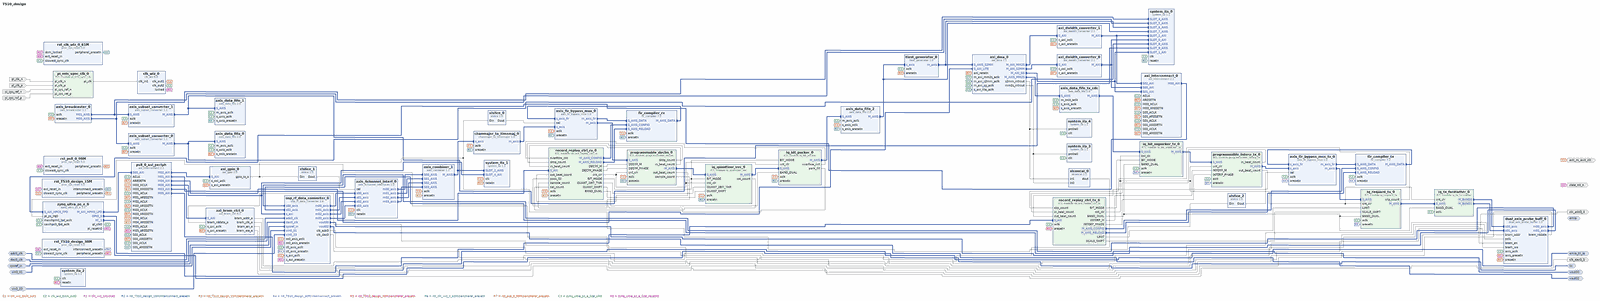
[diagram p0: block diagram of the top level, whole]
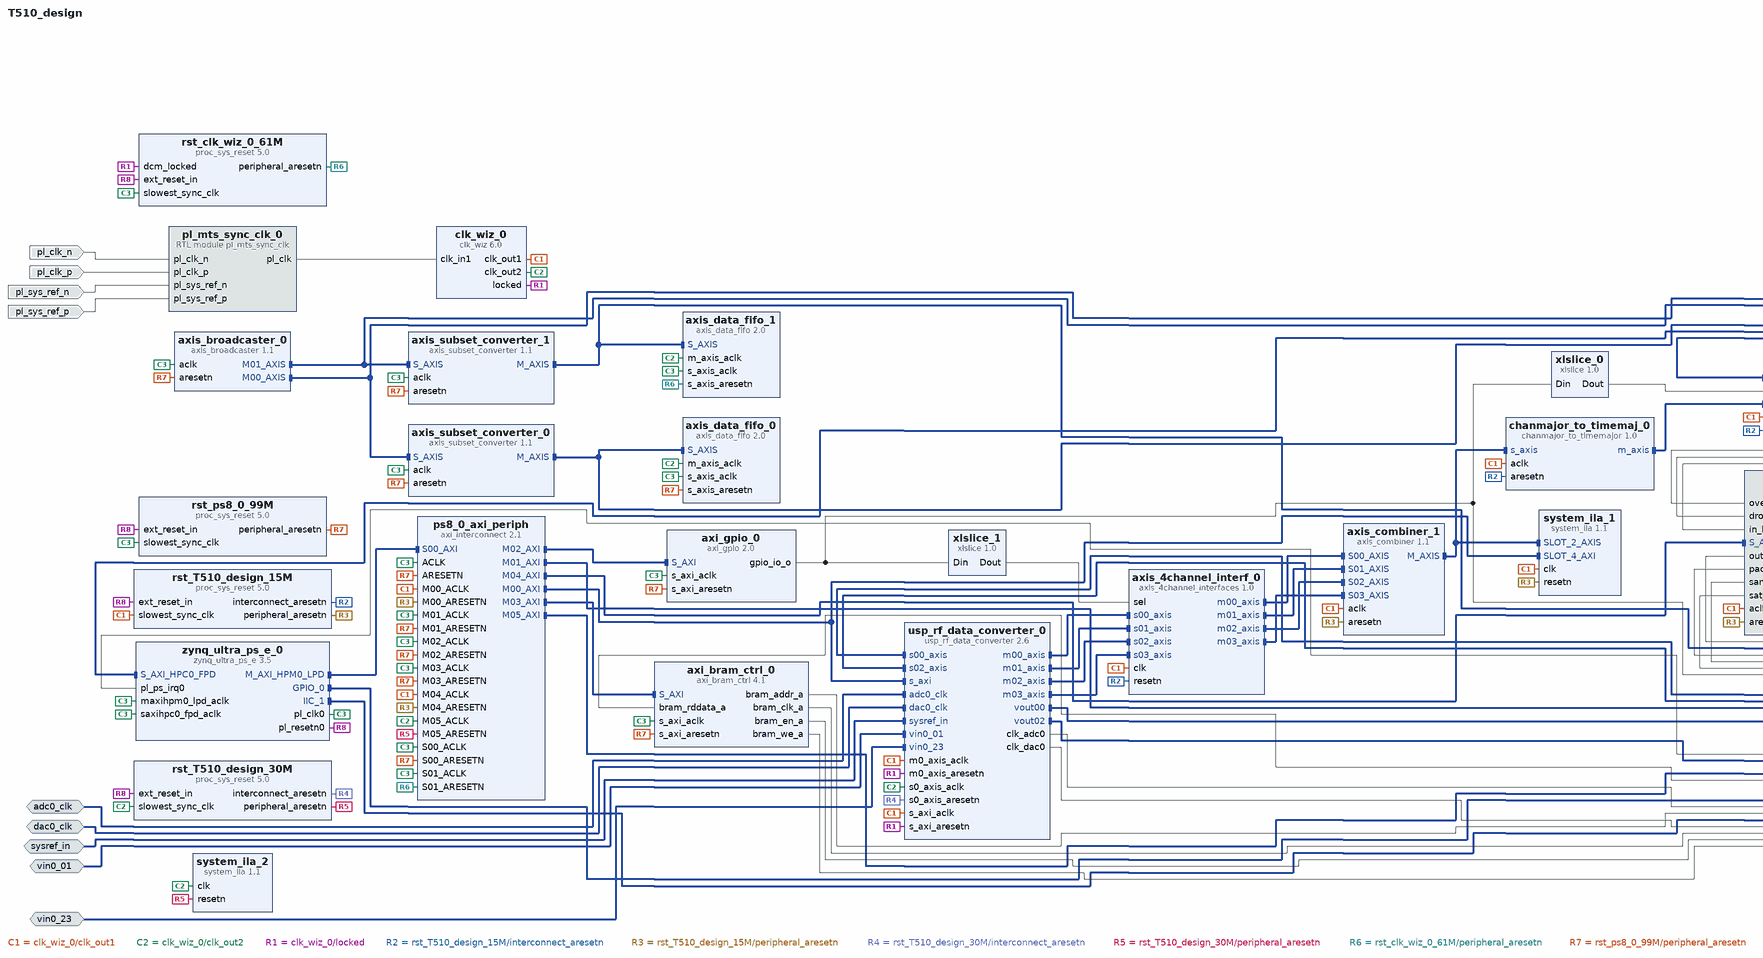
[diagram p1: block diagram of the top level, left part]
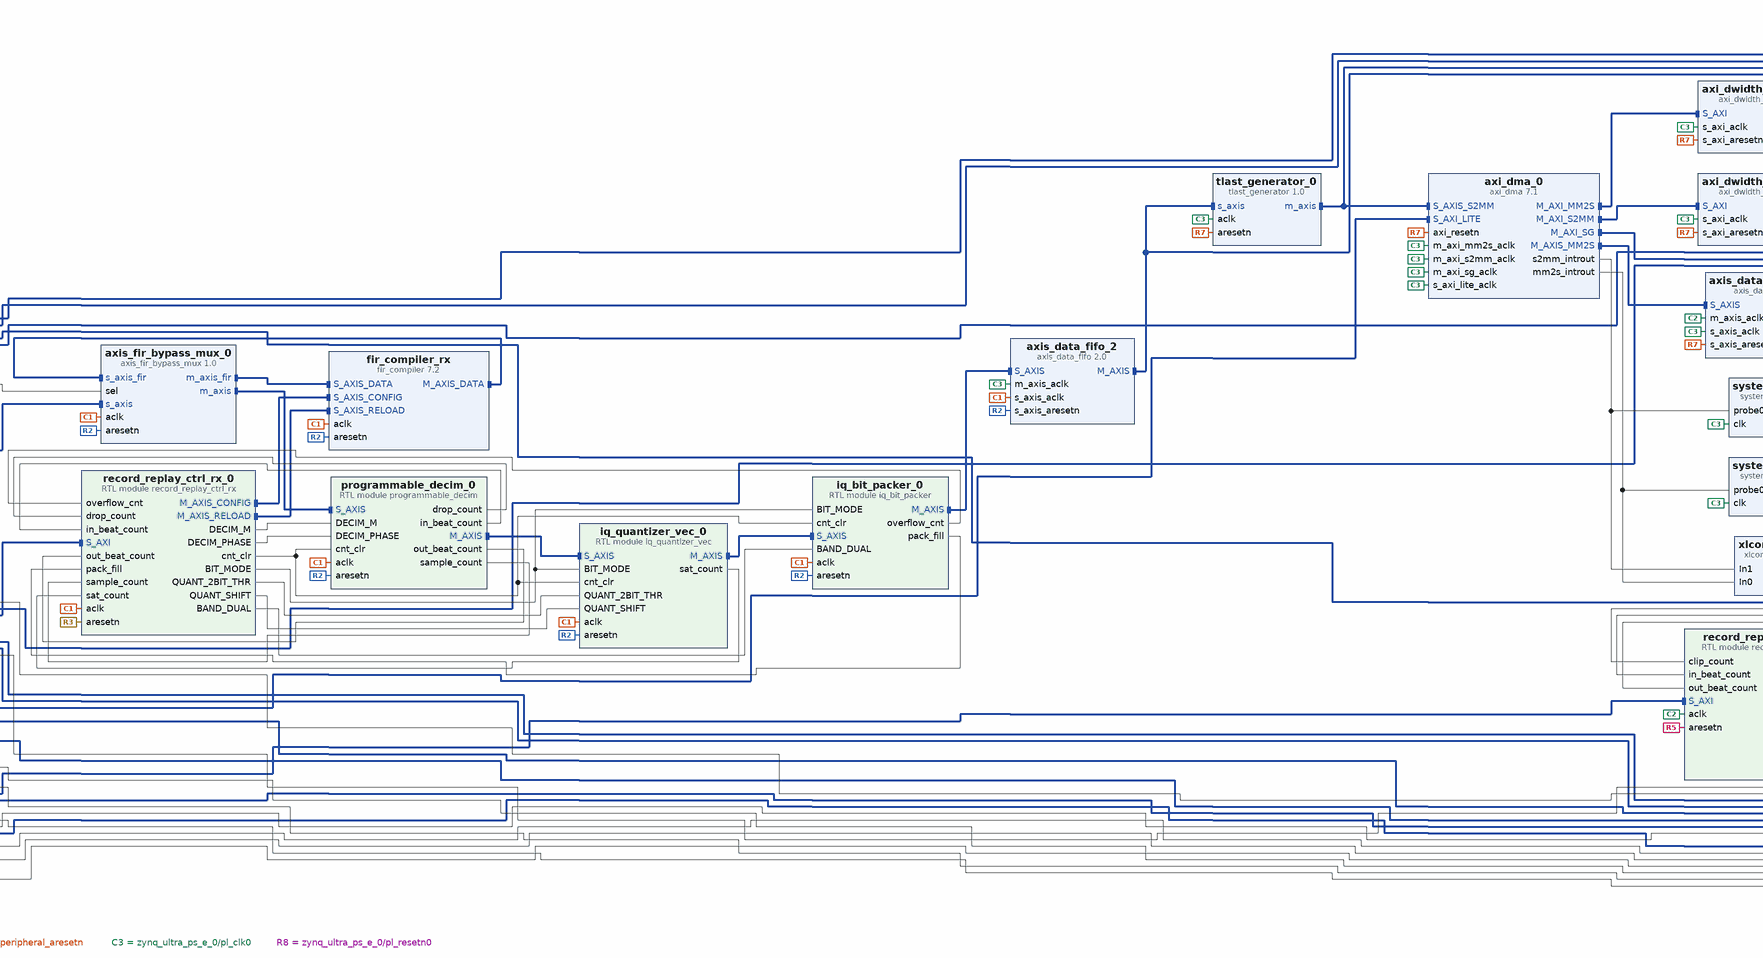
[diagram p2: block diagram of the top level, centre part]
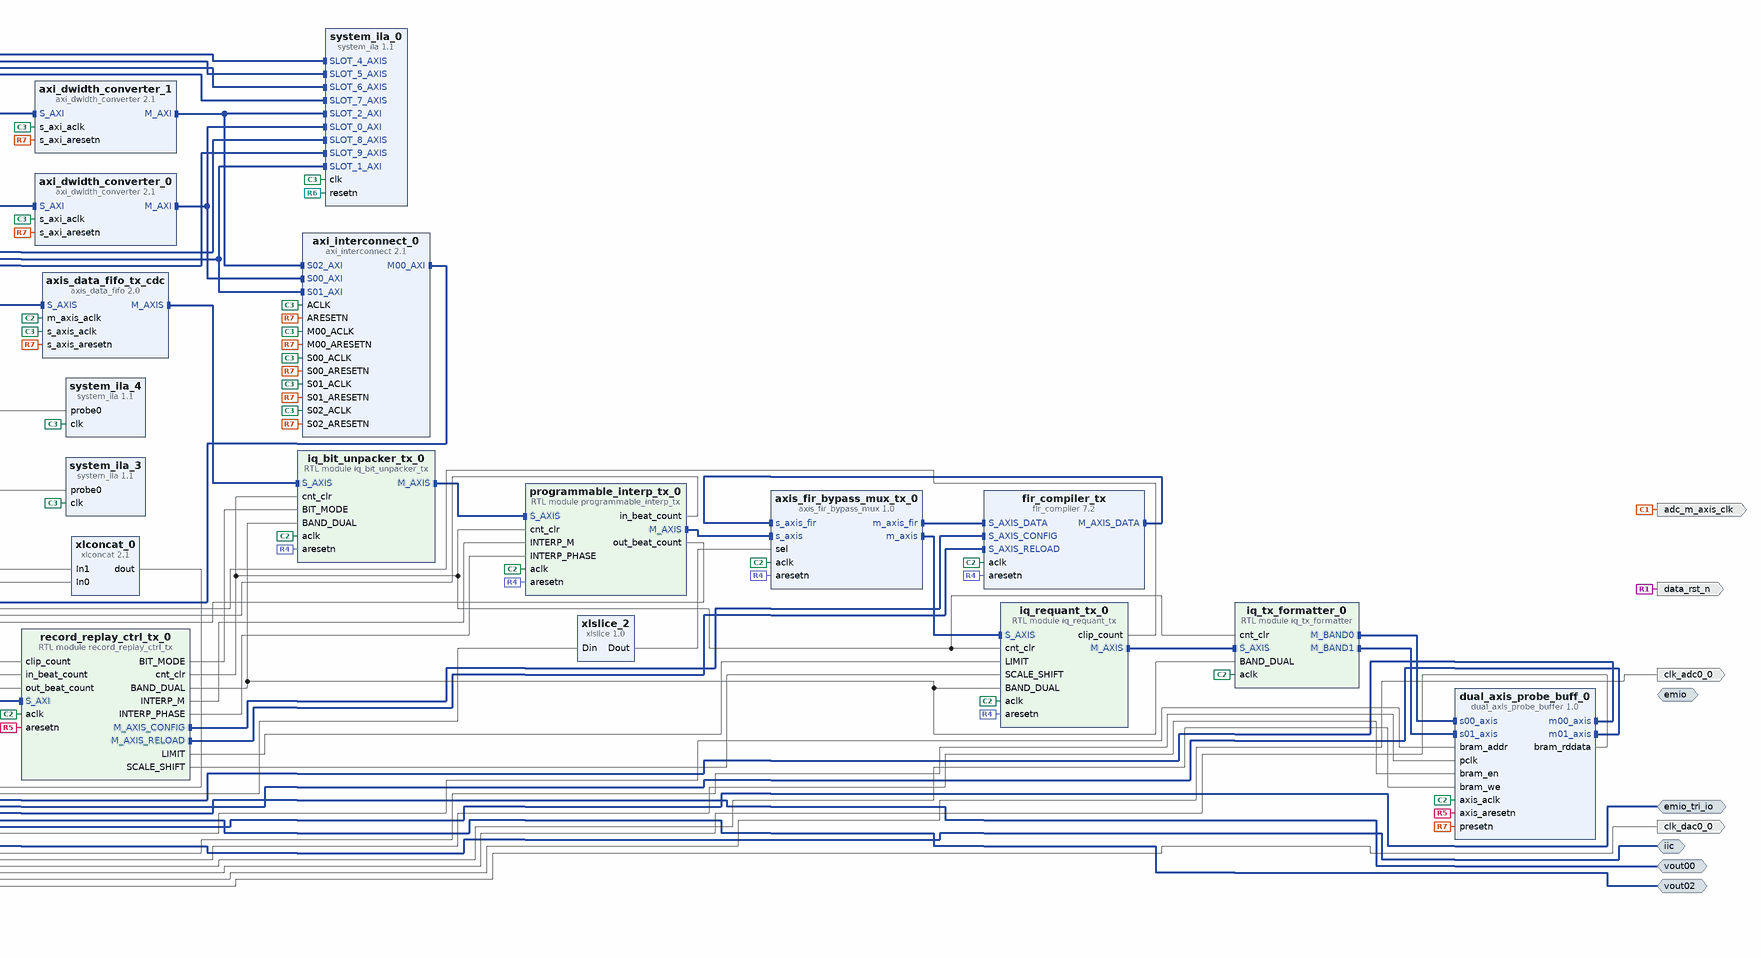
[diagram p3: block diagram of the top level, right part]
# Vivado block design T510_design, xczu47dr-ffve1156-2-i, Vivado 2024.2
create_bd_design T510_design

create_bd_intf_port -mode Master -vlnv xilinx.com:interface:gpio_rtl:1.0 emio
create_bd_intf_port -mode Master -vlnv xilinx.com:interface:iic_rtl:1.0 iic
create_bd_intf_port -mode Master -vlnv xilinx.com:interface:diff_analog_io_rtl:1.0 vout00
create_bd_intf_port -mode Master -vlnv xilinx.com:interface:diff_analog_io_rtl:1.0 vout02
create_bd_intf_port -mode Slave -vlnv xilinx.com:interface:diff_analog_io_rtl:1.0 vin0_01
create_bd_intf_port -mode Slave -vlnv xilinx.com:display_usp_rf_data_converter:diff_pins_rtl:1.0 sysref_in
create_bd_intf_port -mode Slave -vlnv xilinx.com:interface:diff_analog_io_rtl:1.0 vin0_23
create_bd_intf_port -mode Slave -vlnv xilinx.com:interface:diff_clock_rtl:1.0 adc0_clk
set_property -dict {CONFIG.FREQ_HZ 245760000.0} [get_bd_intf_ports adc0_clk]
create_bd_intf_port -mode Slave -vlnv xilinx.com:interface:diff_clock_rtl:1.0 dac0_clk
set_property -dict {CONFIG.FREQ_HZ 245760000.0} [get_bd_intf_ports dac0_clk]
create_bd_intf_port -mode Master -vlnv xilinx.com:interface:gpio_rtl:1.0 emio_tri_io
create_bd_port -dir I -type clk pl_clk_p
create_bd_port -dir I -type clk pl_clk_n
create_bd_port -dir I pl_sys_ref_p
create_bd_port -dir I pl_sys_ref_n
create_bd_port -dir O -type clk adc_m_axis_clk
create_bd_port -dir O data_rst_n
create_bd_port -dir O -type clk clk_adc0_0
create_bd_port -dir O -type clk clk_dac0_0

create_bd_cell -type ip -vlnv xilinx.com:ip:usp_rf_data_converter:2.6 usp_rf_data_converter_0
set_property -dict [list \
  CONFIG.ADC0_Clock_Source 0 \
  CONFIG.ADC0_Multi_Tile_Sync false \
  CONFIG.ADC0_Outclk_Freq 38.400 \
  CONFIG.ADC0_PLL_Enable true \
  CONFIG.ADC0_Refclk_Freq 245.760 \
  CONFIG.ADC0_Sampling_Rate 4.9152 \
  CONFIG.ADC_Data_Type00 1 \
  CONFIG.ADC_Data_Type02 1 \
  CONFIG.ADC_Data_Width00 8 \
  CONFIG.ADC_Data_Width02 8 \
  CONFIG.ADC_Decimation_Mode00 40 \
  CONFIG.ADC_Decimation_Mode02 40 \
  CONFIG.ADC_Mixer_Mode00 0 \
  CONFIG.ADC_Mixer_Mode02 0 \
  CONFIG.ADC_Mixer_Type00 2 \
  CONFIG.ADC_Mixer_Type02 2 \
  CONFIG.ADC_NCO_Freq00 1.585 \
  CONFIG.ADC_NCO_Freq02 1.176 \
  CONFIG.ADC_Slice02_Enable true \
  CONFIG.ADC_Slice10_Enable false \
  CONFIG.ADC_Slice12_Enable false \
  CONFIG.ADC_Slice20_Enable false \
  CONFIG.ADC_Slice22_Enable false \
  CONFIG.ADC_Slice30_Enable false \
  CONFIG.ADC_Slice32_Enable false \
  CONFIG.DAC0_Clock_Source 4 \
  CONFIG.DAC0_Multi_Tile_Sync false \
  CONFIG.DAC0_Outclk_Freq 38.400 \
  CONFIG.DAC0_PLL_Enable true \
  CONFIG.DAC0_Refclk_Freq 245.760 \
  CONFIG.DAC0_Sampling_Rate 4.9152 \
  CONFIG.DAC_Data_Type00 0 \
  CONFIG.DAC_Data_Width00 8 \
  CONFIG.DAC_Data_Width02 8 \
  CONFIG.DAC_Interpolation_Mode00 40 \
  CONFIG.DAC_Interpolation_Mode02 40 \
  CONFIG.DAC_Mixer_Mode00 0 \
  CONFIG.DAC_Mixer_Mode02 0 \
  CONFIG.DAC_Mixer_Type00 2 \
  CONFIG.DAC_Mixer_Type02 2 \
  CONFIG.DAC_NCO_Freq00 1.585 \
  CONFIG.DAC_NCO_Freq02 1.176 \
  CONFIG.DAC_Slice00_Enable true \
  CONFIG.DAC_Slice02_Enable true \
  CONFIG.DAC_Slice10_Enable false \
  CONFIG.DAC_Slice12_Enable false \
  CONFIG.DAC_Slice20_Enable false \
  CONFIG.DAC_Slice22_Enable false \
  CONFIG.DAC_Slice30_Enable false \
  CONFIG.DAC_Slice32_Enable false \
] [get_bd_cells usp_rf_data_converter_0]
create_bd_cell -type ip -vlnv xilinx.com:ip:zynq_ultra_ps_e:3.5 zynq_ultra_ps_e_0
set_property -dict [list \
  CONFIG.CAN0_BOARD_INTERFACE custom \
  CONFIG.CAN1_BOARD_INTERFACE custom \
  CONFIG.CSU_BOARD_INTERFACE custom \
  CONFIG.DP_BOARD_INTERFACE custom \
  CONFIG.GEM0_BOARD_INTERFACE custom \
  CONFIG.GEM1_BOARD_INTERFACE custom \
  CONFIG.GEM2_BOARD_INTERFACE custom \
  CONFIG.GEM3_BOARD_INTERFACE custom \
  CONFIG.GPIO_BOARD_INTERFACE custom \
  CONFIG.IIC0_BOARD_INTERFACE custom \
  CONFIG.IIC1_BOARD_INTERFACE custom \
  CONFIG.NAND_BOARD_INTERFACE custom \
  CONFIG.PCIE_BOARD_INTERFACE custom \
  CONFIG.PJTAG_BOARD_INTERFACE custom \
  CONFIG.PMU_BOARD_INTERFACE custom \
  CONFIG.PSU_BANK_0_IO_STANDARD LVCMOS18 \
  CONFIG.PSU_BANK_1_IO_STANDARD LVCMOS18 \
  CONFIG.PSU_BANK_2_IO_STANDARD LVCMOS18 \
  CONFIG.PSU_BANK_3_IO_STANDARD LVCMOS33 \
  CONFIG.PSU_USB3__DUAL_CLOCK_ENABLE 1 \
  CONFIG.PSU__AFI0_COHERENCY 1 \
  CONFIG.PSU__CAN1__PERIPHERAL__ENABLE 0 \
  CONFIG.PSU__CRF_APB__ACPU_CTRL__FREQMHZ 1333.333 \
  CONFIG.PSU__CRF_APB__ACPU_CTRL__SRCSEL APLL \
  CONFIG.PSU__CRF_APB__APLL_CTRL__SRCSEL PSS_REF_CLK \
  CONFIG.PSU__CRF_APB__DBG_FPD_CTRL__FREQMHZ 250 \
  CONFIG.PSU__CRF_APB__DBG_FPD_CTRL__SRCSEL IOPLL \
  CONFIG.PSU__CRF_APB__DBG_TRACE_CTRL__FREQMHZ 250 \
  CONFIG.PSU__CRF_APB__DBG_TRACE_CTRL__SRCSEL IOPLL \
  CONFIG.PSU__CRF_APB__DBG_TSTMP_CTRL__FREQMHZ 250 \
  CONFIG.PSU__CRF_APB__DBG_TSTMP_CTRL__SRCSEL IOPLL \
  CONFIG.PSU__CRF_APB__DDR_CTRL__FREQMHZ 1200 \
  CONFIG.PSU__CRF_APB__DDR_CTRL__SRCSEL DPLL \
  CONFIG.PSU__CRF_APB__DPDMA_REF_CTRL__FREQMHZ 600 \
  CONFIG.PSU__CRF_APB__DPDMA_REF_CTRL__SRCSEL DPLL \
  CONFIG.PSU__CRF_APB__DPLL_CTRL__SRCSEL PSS_REF_CLK \
  CONFIG.PSU__CRF_APB__DP_AUDIO_REF_CTRL__SRCSEL VPLL \
  CONFIG.PSU__CRF_APB__DP_STC_REF_CTRL__SRCSEL VPLL \
  CONFIG.PSU__CRF_APB__DP_VIDEO_REF_CTRL__SRCSEL DPLL \
  CONFIG.PSU__CRF_APB__GDMA_REF_CTRL__FREQMHZ 600 \
  CONFIG.PSU__CRF_APB__GDMA_REF_CTRL__SRCSEL DPLL \
  CONFIG.PSU__CRF_APB__GPU_REF_CTRL__FREQMHZ 600 \
  CONFIG.PSU__CRF_APB__GPU_REF_CTRL__SRCSEL DPLL \
  CONFIG.PSU__CRF_APB__TOPSW_LSBUS_CTRL__FREQMHZ 100 \
  CONFIG.PSU__CRF_APB__TOPSW_LSBUS_CTRL__SRCSEL IOPLL \
  CONFIG.PSU__CRF_APB__TOPSW_MAIN_CTRL__FREQMHZ 533.333 \
  CONFIG.PSU__CRF_APB__TOPSW_MAIN_CTRL__SRCSEL VPLL \
  CONFIG.PSU__CRF_APB__VPLL_CTRL__SRCSEL PSS_REF_CLK \
  CONFIG.PSU__CRL_APB__ADMA_REF_CTRL__FREQMHZ 533.333 \
  CONFIG.PSU__CRL_APB__ADMA_REF_CTRL__SRCSEL RPLL \
  CONFIG.PSU__CRL_APB__CAN1_REF_CTRL__FREQMHZ 100 \
  CONFIG.PSU__CRL_APB__CAN1_REF_CTRL__SRCSEL IOPLL \
  CONFIG.PSU__CRL_APB__CPU_R5_CTRL__FREQMHZ 533.333 \
  CONFIG.PSU__CRL_APB__CPU_R5_CTRL__SRCSEL RPLL \
  CONFIG.PSU__CRL_APB__DBG_LPD_CTRL__FREQMHZ 250 \
  CONFIG.PSU__CRL_APB__DBG_LPD_CTRL__SRCSEL IOPLL \
  CONFIG.PSU__CRL_APB__GEM3_REF_CTRL__FREQMHZ 125 \
  CONFIG.PSU__CRL_APB__GEM3_REF_CTRL__SRCSEL IOPLL \
  CONFIG.PSU__CRL_APB__I2C0_REF_CTRL__FREQMHZ 100 \
  CONFIG.PSU__CRL_APB__I2C0_REF_CTRL__SRCSEL IOPLL \
  CONFIG.PSU__CRL_APB__I2C1_REF_CTRL__FREQMHZ 100 \
  CONFIG.PSU__CRL_APB__I2C1_REF_CTRL__SRCSEL IOPLL \
  CONFIG.PSU__CRL_APB__IOPLL_CTRL__SRCSEL PSS_REF_CLK \
  CONFIG.PSU__CRL_APB__IOU_SWITCH_CTRL__FREQMHZ 267 \
  CONFIG.PSU__CRL_APB__IOU_SWITCH_CTRL__SRCSEL RPLL \
  CONFIG.PSU__CRL_APB__LPD_LSBUS_CTRL__FREQMHZ 100 \
  CONFIG.PSU__CRL_APB__LPD_LSBUS_CTRL__SRCSEL IOPLL \
  CONFIG.PSU__CRL_APB__LPD_SWITCH_CTRL__FREQMHZ 533.333 \
  CONFIG.PSU__CRL_APB__LPD_SWITCH_CTRL__SRCSEL RPLL \
  CONFIG.PSU__CRL_APB__PCAP_CTRL__FREQMHZ 200 \
  CONFIG.PSU__CRL_APB__PCAP_CTRL__SRCSEL IOPLL \
  CONFIG.PSU__CRL_APB__PL0_REF_CTRL__FREQMHZ 100 \
  CONFIG.PSU__CRL_APB__PL0_REF_CTRL__SRCSEL RPLL \
  CONFIG.PSU__CRL_APB__QSPI_REF_CTRL__FREQMHZ 300 \
  CONFIG.PSU__CRL_APB__QSPI_REF_CTRL__SRCSEL IOPLL \
  CONFIG.PSU__CRL_APB__RPLL_CTRL__SRCSEL PSS_REF_CLK \
  CONFIG.PSU__CRL_APB__SDIO1_REF_CTRL__FREQMHZ 200 \
  CONFIG.PSU__CRL_APB__SDIO1_REF_CTRL__SRCSEL RPLL \
  CONFIG.PSU__CRL_APB__TIMESTAMP_REF_CTRL__FREQMHZ 100 \
  CONFIG.PSU__CRL_APB__TIMESTAMP_REF_CTRL__SRCSEL PSS_REF_CLK \
  CONFIG.PSU__CRL_APB__UART0_REF_CTRL__FREQMHZ 100 \
  CONFIG.PSU__CRL_APB__UART0_REF_CTRL__SRCSEL IOPLL \
  CONFIG.PSU__CRL_APB__UART1_REF_CTRL__FREQMHZ 100 \
  CONFIG.PSU__CRL_APB__UART1_REF_CTRL__SRCSEL IOPLL \
  CONFIG.PSU__CRL_APB__USB0_BUS_REF_CTRL__FREQMHZ 250 \
  CONFIG.PSU__CRL_APB__USB0_BUS_REF_CTRL__SRCSEL IOPLL \
  CONFIG.PSU__CRL_APB__USB3_DUAL_REF_CTRL__FREQMHZ 20 \
  CONFIG.PSU__CRL_APB__USB3_DUAL_REF_CTRL__SRCSEL IOPLL \
  CONFIG.PSU__CRL_APB__USB3__ENABLE 1 \
  CONFIG.PSU__CSUPMU__PERIPHERAL__VALID 0 \
  CONFIG.PSU__DDRC__BUS_WIDTH {64 Bit} \
  CONFIG.PSU__DDRC__COMPONENTS Components \
  CONFIG.PSU__DDRC__DEVICE_CAPACITY {8192 MBits} \
  CONFIG.PSU__DDRC__DRAM_WIDTH {16 Bits} \
  CONFIG.PSU__DDRC__ECC Disabled \
  CONFIG.PSU__DDRC__MEMORY_TYPE {DDR 4} \
  CONFIG.PSU__DDRC__SPEED_BIN DDR4_2400P \
  CONFIG.PSU__DDR_HIGH_ADDRESS_GUI_ENABLE 1 \
  CONFIG.PSU__DDR__INTERFACE__FREQMHZ 600.000 \
  CONFIG.PSU__DEVICE_TYPE RFSOC \
  CONFIG.PSU__DISPLAYPORT__PERIPHERAL__ENABLE 0 \
  CONFIG.PSU__DLL__ISUSED 1 \
  CONFIG.PSU__ENET3__FIFO__ENABLE 0 \
  CONFIG.PSU__ENET3__GRP_MDIO__ENABLE 1 \
  CONFIG.PSU__ENET3__GRP_MDIO__IO {MIO 76 .. 77} \
  CONFIG.PSU__ENET3__PERIPHERAL__ENABLE 1 \
  CONFIG.PSU__ENET3__PERIPHERAL__IO {MIO 64 .. 75} \
  CONFIG.PSU__ENET3__PTP__ENABLE 0 \
  CONFIG.PSU__ENET3__TSU__ENABLE 0 \
  CONFIG.PSU__FPD_SLCR__WDT1__FREQMHZ 100 \
  CONFIG.PSU__FPGA_PL0_ENABLE 1 \
  CONFIG.PSU__GEM3_COHERENCY 0 \
  CONFIG.PSU__GEM3_ROUTE_THROUGH_FPD 0 \
  CONFIG.PSU__GEM__TSU__ENABLE 0 \
  CONFIG.PSU__GPIO0_MIO__IO {MIO 0 .. 25} \
  CONFIG.PSU__GPIO0_MIO__PERIPHERAL__ENABLE 1 \
  CONFIG.PSU__GPIO1_MIO__IO {MIO 26 .. 51} \
  CONFIG.PSU__GPIO1_MIO__PERIPHERAL__ENABLE 1 \
  CONFIG.PSU__GPIO_EMIO__PERIPHERAL__ENABLE 1 \
  CONFIG.PSU__GPIO_EMIO__PERIPHERAL__IO 1 \
  CONFIG.PSU__GPU_PP0__POWER__ON 0 \
  CONFIG.PSU__GPU_PP1__POWER__ON 0 \
  CONFIG.PSU__I2C0__PERIPHERAL__ENABLE 0 \
  CONFIG.PSU__I2C1__PERIPHERAL__ENABLE 1 \
  CONFIG.PSU__I2C1__PERIPHERAL__IO EMIO \
  CONFIG.PSU__IOU_SLCR__IOU_TTC_APB_CLK__TTC0_SEL APB \
  CONFIG.PSU__IOU_SLCR__IOU_TTC_APB_CLK__TTC1_SEL APB \
  CONFIG.PSU__IOU_SLCR__IOU_TTC_APB_CLK__TTC2_SEL APB \
  CONFIG.PSU__IOU_SLCR__IOU_TTC_APB_CLK__TTC3_SEL APB \
  CONFIG.PSU__IOU_SLCR__TTC1__FREQMHZ 100 \
  CONFIG.PSU__IOU_SLCR__TTC2__FREQMHZ 100 \
  CONFIG.PSU__IOU_SLCR__TTC3__FREQMHZ 100 \
  CONFIG.PSU__IOU_SLCR__WDT0__FREQMHZ 100 \
  CONFIG.PSU__LPD_SLCR__CSUPMU__FREQMHZ 100 \
  CONFIG.PSU__OVERRIDE_HPX_QOS 0 \
  CONFIG.PSU__OVERRIDE__BASIC_CLOCK 0 \
  CONFIG.PSU__PCIE__BAR0_VAL 0x0 \
  CONFIG.PSU__PCIE__BAR1_VAL 0x0 \
  CONFIG.PSU__PCIE__BAR2_VAL 0x0 \
  CONFIG.PSU__PCIE__BAR3_VAL 0x0 \
  CONFIG.PSU__PCIE__BAR4_VAL 0x0 \
  CONFIG.PSU__PCIE__BAR5_VAL 0x0 \
  CONFIG.PSU__PCIE__CLASS_CODE_BASE 0x06 \
  CONFIG.PSU__PCIE__CLASS_CODE_INTERFACE 0x0 \
  CONFIG.PSU__PCIE__CLASS_CODE_SUB 0x4 \
  CONFIG.PSU__PCIE__CLASS_CODE_VALUE 0x60400 \
  CONFIG.PSU__PCIE__DEVICE_ID 0xD022 \
  CONFIG.PSU__PCIE__DEVICE_PORT_TYPE {Root Port} \
  CONFIG.PSU__PCIE__EROM_VAL 0x0 \
  CONFIG.PSU__PCIE__LANE0__ENABLE 1 \
  CONFIG.PSU__PCIE__LANE0__IO {GT Lane0} \
  CONFIG.PSU__PCIE__LANE1__ENABLE 1 \
  CONFIG.PSU__PCIE__LANE1__IO {GT Lane1} \
  CONFIG.PSU__PCIE__LINK_SPEED {5.0 Gb/s} \
  CONFIG.PSU__PCIE__MAXIMUM_LINK_WIDTH x2 \
  CONFIG.PSU__PCIE__MAX_PAYLOAD_SIZE {256 bytes} \
  CONFIG.PSU__PCIE__PERIPHERAL__ENABLE 1 \
  CONFIG.PSU__PCIE__PERIPHERAL__ENDPOINT_ENABLE 0 \
  CONFIG.PSU__PCIE__PERIPHERAL__ROOTPORT_ENABLE 1 \
  CONFIG.PSU__PCIE__PERIPHERAL__ROOTPORT_IO {MIO 31} \
  CONFIG.PSU__PCIE__REF_CLK_FREQ 100 \
  CONFIG.PSU__PCIE__REF_CLK_SEL {Ref Clk0} \
  CONFIG.PSU__PCIE__REVISION_ID 0x0 \
  CONFIG.PSU__PCIE__SUBSYSTEM_ID 0x7 \
  CONFIG.PSU__PCIE__SUBSYSTEM_VENDOR_ID 0x10EE \
  CONFIG.PSU__PCIE__VENDOR_ID 0x10EE \
  CONFIG.PSU__PMU__PERIPHERAL__ENABLE 0 \
  CONFIG.PSU__PRESET_APPLIED 0 \
  CONFIG.PSU__PSS_REF_CLK__FREQMHZ 33.333 \
  CONFIG.PSU__QSPI_COHERENCY 0 \
  CONFIG.PSU__QSPI_ROUTE_THROUGH_FPD 0 \
  CONFIG.PSU__QSPI__GRP_FBCLK__ENABLE 0 \
  CONFIG.PSU__QSPI__PERIPHERAL__DATA_MODE x4 \
  CONFIG.PSU__QSPI__PERIPHERAL__ENABLE 1 \
  CONFIG.PSU__QSPI__PERIPHERAL__IO {MIO 0 .. 12} \
  CONFIG.PSU__QSPI__PERIPHERAL__MODE {Dual Parallel} \
  CONFIG.PSU__SATA__PERIPHERAL__ENABLE 0 \
  CONFIG.PSU__SD0__CLK_200_SDR_OTAP_DLY 0x3 \
  CONFIG.PSU__SD0__CLK_50_DDR_ITAP_DLY 0x12 \
  CONFIG.PSU__SD0__CLK_50_DDR_OTAP_DLY 0x6 \
  CONFIG.PSU__SD0__CLK_50_SDR_ITAP_DLY 0x15 \
  CONFIG.PSU__SD0__CLK_50_SDR_OTAP_DLY 0x6 \
  CONFIG.PSU__SD0__DATA_TRANSFER_MODE 8Bit \
  CONFIG.PSU__SD0__GRP_POW__ENABLE 1 \
  CONFIG.PSU__SD0__GRP_POW__IO {MIO 23} \
  CONFIG.PSU__SD0__PERIPHERAL__ENABLE 1 \
  CONFIG.PSU__SD0__PERIPHERAL__IO {MIO 13 .. 22} \
  CONFIG.PSU__SD0__RESET__ENABLE 1 \
  CONFIG.PSU__SD0__SLOT_TYPE eMMC \
  CONFIG.PSU__SD1_COHERENCY 0 \
  CONFIG.PSU__SD1_ROUTE_THROUGH_FPD 0 \
  CONFIG.PSU__SD1__CLK_50_SDR_ITAP_DLY 0x15 \
  CONFIG.PSU__SD1__CLK_50_SDR_OTAP_DLY 0x5 \
  CONFIG.PSU__SD1__DATA_TRANSFER_MODE 4Bit \
  CONFIG.PSU__SD1__GRP_CD__ENABLE 1 \
  CONFIG.PSU__SD1__GRP_CD__IO {MIO 45} \
  CONFIG.PSU__SD1__GRP_POW__ENABLE 0 \
  CONFIG.PSU__SD1__GRP_WP__ENABLE 0 \
  CONFIG.PSU__SD1__PERIPHERAL__ENABLE 1 \
  CONFIG.PSU__SD1__PERIPHERAL__IO {MIO 46 .. 51} \
  CONFIG.PSU__SD1__SLOT_TYPE {SD 2.0} \
  CONFIG.PSU__SPI1__GRP_SS0__IO {MIO 35} \
  CONFIG.PSU__SPI1__PERIPHERAL__ENABLE 1 \
  CONFIG.PSU__SPI1__PERIPHERAL__IO {MIO 32 .. 37} \
  CONFIG.PSU__SWDT0__PERIPHERAL__ENABLE 0 \
  CONFIG.PSU__SWDT1__PERIPHERAL__ENABLE 0 \
  CONFIG.PSU__TSU__BUFG_PORT_PAIR 0 \
  CONFIG.PSU__TTC0__CLOCK__ENABLE 0 \
  CONFIG.PSU__TTC0__PERIPHERAL__ENABLE 1 \
  CONFIG.PSU__TTC0__WAVEOUT__ENABLE 0 \
  CONFIG.PSU__TTC1__PERIPHERAL__ENABLE 0 \
  CONFIG.PSU__TTC2__PERIPHERAL__ENABLE 0 \
  CONFIG.PSU__TTC3__PERIPHERAL__ENABLE 0 \
  CONFIG.PSU__UART0__PERIPHERAL__ENABLE 0 \
  CONFIG.PSU__UART1__BAUD_RATE 115200 \
  CONFIG.PSU__UART1__MODEM__ENABLE 0 \
  CONFIG.PSU__UART1__PERIPHERAL__ENABLE 1 \
  CONFIG.PSU__UART1__PERIPHERAL__IO {MIO 40 .. 41} \
  CONFIG.PSU__USB0_COHERENCY 0 \
  CONFIG.PSU__USB0__PERIPHERAL__ENABLE 1 \
  CONFIG.PSU__USB0__PERIPHERAL__IO {MIO 52 .. 63} \
  CONFIG.PSU__USB0__REF_CLK_FREQ 100 \
  CONFIG.PSU__USB0__REF_CLK_SEL {Ref Clk2} \
  CONFIG.PSU__USB0__RESET__ENABLE 1 \
  CONFIG.PSU__USB0__RESET__IO {MIO 43} \
  CONFIG.PSU__USB2_0__EMIO__ENABLE 0 \
  CONFIG.PSU__USB3_0__EMIO__ENABLE 0 \
  CONFIG.PSU__USB3_0__PERIPHERAL__ENABLE 1 \
  CONFIG.PSU__USB3_0__PERIPHERAL__IO {GT Lane2} \
  CONFIG.PSU__USB__RESET__MODE {Separate MIO Pin} \
  CONFIG.PSU__USB__RESET__POLARITY {Active Low} \
  CONFIG.PSU__USE__IRQ0 1 \
  CONFIG.PSU__USE__M_AXI_GP0 0 \
  CONFIG.PSU__USE__M_AXI_GP1 0 \
  CONFIG.PSU__USE__M_AXI_GP2 1 \
  CONFIG.PSU__USE__S_AXI_GP0 1 \
  CONFIG.QSPI_BOARD_INTERFACE custom \
  CONFIG.SATA_BOARD_INTERFACE custom \
  CONFIG.SD0_BOARD_INTERFACE custom \
  CONFIG.SD1_BOARD_INTERFACE custom \
  CONFIG.SPI0_BOARD_INTERFACE custom \
  CONFIG.SPI1_BOARD_INTERFACE custom \
  CONFIG.SUBPRESET1 Custom \
  CONFIG.SUBPRESET2 Custom \
  CONFIG.SWDT0_BOARD_INTERFACE custom \
  CONFIG.SWDT1_BOARD_INTERFACE custom \
  CONFIG.TRACE_BOARD_INTERFACE custom \
  CONFIG.TTC0_BOARD_INTERFACE custom \
  CONFIG.TTC1_BOARD_INTERFACE custom \
  CONFIG.TTC2_BOARD_INTERFACE custom \
  CONFIG.TTC3_BOARD_INTERFACE custom \
  CONFIG.UART0_BOARD_INTERFACE custom \
  CONFIG.UART1_BOARD_INTERFACE custom \
  CONFIG.USB0_BOARD_INTERFACE custom \
  CONFIG.USB1_BOARD_INTERFACE custom \
] [get_bd_cells zynq_ultra_ps_e_0]
# 733 more settings of zynq_ultra_ps_e_0 are not shown: defaults, MIO pin electricals, DDR timing, and values the tool derives
create_bd_cell -type ip -vlnv xilinx.com:ip:axi_interconnect:2.1 ps8_0_axi_periph
set_property -dict {CONFIG.NUM_MI 6 CONFIG.NUM_SI 2} [get_bd_cells ps8_0_axi_periph]
create_bd_cell -type ip -vlnv xilinx.com:ip:proc_sys_reset:5.0 rst_ps8_0_99M
create_bd_cell -type module -reference pl_mts_sync_clk pl_mts_sync_clk_0
create_bd_cell -type ip -vlnv xilinx.com:ip:clk_wiz:6.0 clk_wiz_0
set_property -dict [list \
  CONFIG.AUTO_PRIMITIVE MMCM \
  CONFIG.CLKIN1_JITTER_PS 40.69 \
  CONFIG.CLKOUT1_DRIVES Buffer \
  CONFIG.CLKOUT1_JITTER 148.112 \
  CONFIG.CLKOUT1_PHASE_ERROR 77.902 \
  CONFIG.CLKOUT1_REQUESTED_OUT_FREQ 15.360 \
  CONFIG.CLKOUT2_DRIVES Buffer \
  CONFIG.CLKOUT2_JITTER 128.705 \
  CONFIG.CLKOUT2_PHASE_ERROR 77.902 \
  CONFIG.CLKOUT2_REQUESTED_OUT_FREQ 30.72 \
  CONFIG.CLKOUT2_USED true \
  CONFIG.CLKOUT3_DRIVES Buffer \
  CONFIG.CLKOUT3_JITTER 150.112 \
  CONFIG.CLKOUT3_PHASE_ERROR 79.770 \
  CONFIG.CLKOUT3_REQUESTED_OUT_FREQ 100.000 \
  CONFIG.CLKOUT3_USED false \
  CONFIG.CLKOUT4_DRIVES Buffer \
  CONFIG.CLKOUT5_DRIVES Buffer \
  CONFIG.CLKOUT6_DRIVES Buffer \
  CONFIG.CLKOUT7_DRIVES Buffer \
  CONFIG.FEEDBACK_SOURCE FDBK_AUTO \
  CONFIG.MMCM_BANDWIDTH OPTIMIZED \
  CONFIG.MMCM_CLKFBOUT_MULT_F 4.875 \
  CONFIG.MMCM_CLKIN1_PERIOD 4.069 \
  CONFIG.MMCM_CLKIN2_PERIOD 10.0 \
  CONFIG.MMCM_CLKOUT0_DIVIDE_F 78.000 \
  CONFIG.MMCM_CLKOUT1_DIVIDE 39 \
  CONFIG.MMCM_CLKOUT2_DIVIDE 1 \
  CONFIG.MMCM_COMPENSATION AUTO \
  CONFIG.MMCM_DIVCLK_DIVIDE 1 \
  CONFIG.NUM_OUT_CLKS 2 \
  CONFIG.OPTIMIZE_CLOCKING_STRUCTURE_EN false \
  CONFIG.PRIMITIVE MMCM \
  CONFIG.PRIM_IN_FREQ 245.76 \
  CONFIG.USE_LOCKED true \
  CONFIG.USE_RESET false \
] [get_bd_cells clk_wiz_0]
create_bd_cell -type ip -vlnv xilinx.com:ip:axis_data_fifo:2.0 axis_data_fifo_0
set_property -dict {CONFIG.FIFO_DEPTH 32768 CONFIG.IS_ACLK_ASYNC 1 CONFIG.TDATA_NUM_BYTES 16} [get_bd_cells axis_data_fifo_0]
create_bd_cell -type ip -vlnv xilinx.com:ip:axis_data_fifo:2.0 axis_data_fifo_1
set_property -dict {CONFIG.FIFO_DEPTH 32768 CONFIG.IS_ACLK_ASYNC 1 CONFIG.TDATA_NUM_BYTES 16} [get_bd_cells axis_data_fifo_1]
create_bd_cell -type ip -vlnv xilinx.com:ip:axi_dma:7.1 axi_dma_0
set_property -dict [list \
  CONFIG.c_include_sg 1 \
  CONFIG.c_m_axi_mm2s_data_width 256 \
  CONFIG.c_m_axis_mm2s_tdata_width 256 \
  CONFIG.c_mm2s_burst_size 128 \
  CONFIG.c_s2mm_burst_size 64 \
  CONFIG.c_sg_length_width 26 \
] [get_bd_cells axi_dma_0]
create_bd_cell -type ip -vlnv xilinx.com:ip:proc_sys_reset:5.0 rst_clk_wiz_0_61M
create_bd_cell -type ip -vlnv xilinx.com:ip:axis_subset_converter:1.1 axis_subset_converter_0
set_property -dict [list \
  CONFIG.HAS_ACLKEN 0 \
  CONFIG.M_HAS_TKEEP 1 \
  CONFIG.M_HAS_TLAST 1 \
  CONFIG.M_HAS_TREADY 1 \
  CONFIG.M_HAS_TSTRB 0 \
  CONFIG.M_TDATA_NUM_BYTES 16 \
  CONFIG.M_TDEST_WIDTH 0 \
  CONFIG.M_TID_WIDTH 0 \
  CONFIG.M_TUSER_WIDTH 0 \
  CONFIG.S_HAS_TKEEP 1 \
  CONFIG.S_HAS_TLAST 1 \
  CONFIG.S_HAS_TREADY 1 \
  CONFIG.S_HAS_TSTRB 0 \
  CONFIG.S_TDATA_NUM_BYTES 32 \
  CONFIG.S_TDEST_WIDTH 0 \
  CONFIG.S_TID_WIDTH 0 \
  CONFIG.S_TUSER_WIDTH 0 \
  CONFIG.TDATA_REMAP {tdata[127:0]} \
  CONFIG.TKEEP_REMAP {tkeep[15:0]} \
  CONFIG.TLAST_REMAP {tlast[0]} \
] [get_bd_cells axis_subset_converter_0]
create_bd_cell -type ip -vlnv xilinx.com:ip:axis_subset_converter:1.1 axis_subset_converter_1
set_property -dict [list \
  CONFIG.HAS_ACLKEN 0 \
  CONFIG.M_HAS_TKEEP 1 \
  CONFIG.M_HAS_TLAST 1 \
  CONFIG.M_HAS_TREADY 1 \
  CONFIG.M_HAS_TSTRB 0 \
  CONFIG.M_TDATA_NUM_BYTES 16 \
  CONFIG.M_TDEST_WIDTH 0 \
  CONFIG.M_TID_WIDTH 0 \
  CONFIG.M_TUSER_WIDTH 0 \
  CONFIG.S_HAS_TKEEP 1 \
  CONFIG.S_HAS_TLAST 1 \
  CONFIG.S_HAS_TREADY 1 \
  CONFIG.S_HAS_TSTRB 0 \
  CONFIG.S_TDATA_NUM_BYTES 32 \
  CONFIG.S_TDEST_WIDTH 0 \
  CONFIG.S_TID_WIDTH 0 \
  CONFIG.S_TUSER_WIDTH 0 \
  CONFIG.TDATA_REMAP {tdata[255:128]} \
  CONFIG.TKEEP_REMAP {tkeep[15:0]} \
  CONFIG.TLAST_REMAP {tlast[0]} \
] [get_bd_cells axis_subset_converter_1]
create_bd_cell -type ip -vlnv xilinx.com:ip:axis_broadcaster:1.1 axis_broadcaster_0
set_property -dict [list \
  CONFIG.HAS_TKEEP 1 \
  CONFIG.HAS_TLAST 1 \
  CONFIG.HAS_TREADY 1 \
  CONFIG.HAS_TSTRB 0 \
  CONFIG.M00_TDATA_REMAP {tdata[255:0]} \
  CONFIG.M01_TDATA_REMAP {tdata[255:0]} \
  CONFIG.M_TDATA_NUM_BYTES 32 \
  CONFIG.M_TUSER_WIDTH 0 \
  CONFIG.S_TDATA_NUM_BYTES 32 \
  CONFIG.S_TUSER_WIDTH 0 \
  CONFIG.TDEST_WIDTH 0 \
  CONFIG.TID_WIDTH 0 \
] [get_bd_cells axis_broadcaster_0]
create_bd_cell -type ip -vlnv xilinx.com:ip:axis_data_fifo:2.0 axis_data_fifo_2
set_property -dict {CONFIG.FIFO_DEPTH 32768 CONFIG.IS_ACLK_ASYNC 1 CONFIG.TDATA_NUM_BYTES 64} [get_bd_cells axis_data_fifo_2]
create_bd_cell -type ip -vlnv xilinx.com:ip:system_ila:1.1 system_ila_0
set_property -dict [list \
  CONFIG.C_MON_TYPE INTERFACE \
  CONFIG.C_NUM_MONITOR_SLOTS 10 \
  CONFIG.C_SLOT_0_APC_EN 0 \
  CONFIG.C_SLOT_0_AXI_AR_SEL_DATA 1 \
  CONFIG.C_SLOT_0_AXI_AR_SEL_TRIG 1 \
  CONFIG.C_SLOT_0_AXI_AW_SEL 0 \
  CONFIG.C_SLOT_0_AXI_AW_SEL_DATA 0 \
  CONFIG.C_SLOT_0_AXI_AW_SEL_TRIG 0 \
  CONFIG.C_SLOT_0_AXI_B_SEL 0 \
  CONFIG.C_SLOT_0_AXI_B_SEL_DATA 0 \
  CONFIG.C_SLOT_0_AXI_B_SEL_TRIG 0 \
  CONFIG.C_SLOT_0_AXI_R_SEL_DATA 1 \
  CONFIG.C_SLOT_0_AXI_R_SEL_TRIG 1 \
  CONFIG.C_SLOT_0_AXI_W_SEL 0 \
  CONFIG.C_SLOT_0_AXI_W_SEL_DATA 0 \
  CONFIG.C_SLOT_0_AXI_W_SEL_TRIG 0 \
  CONFIG.C_SLOT_0_INTF_TYPE xilinx.com:interface:aximm_rtl:1.0 \
  CONFIG.C_SLOT_10_APC_EN 0 \
  CONFIG.C_SLOT_10_AXI_DATA_SEL 1 \
  CONFIG.C_SLOT_10_AXI_TRIG_SEL 1 \
  CONFIG.C_SLOT_10_INTF_TYPE xilinx.com:interface:axis_rtl:1.0 \
  CONFIG.C_SLOT_11_APC_EN 0 \
  CONFIG.C_SLOT_11_AXI_DATA_SEL 1 \
  CONFIG.C_SLOT_11_AXI_TRIG_SEL 1 \
  CONFIG.C_SLOT_11_INTF_TYPE xilinx.com:interface:axis_rtl:1.0 \
  CONFIG.C_SLOT_12_APC_EN 0 \
  CONFIG.C_SLOT_12_AXI_DATA_SEL 1 \
  CONFIG.C_SLOT_12_AXI_TRIG_SEL 1 \
  CONFIG.C_SLOT_12_INTF_TYPE xilinx.com:interface:axis_rtl:1.0 \
  CONFIG.C_SLOT_1_APC_EN 0 \
  CONFIG.C_SLOT_1_AXI_AR_SEL 0 \
  CONFIG.C_SLOT_1_AXI_AR_SEL_DATA 0 \
  CONFIG.C_SLOT_1_AXI_AR_SEL_TRIG 0 \
  CONFIG.C_SLOT_1_AXI_AW_SEL_DATA 1 \
  CONFIG.C_SLOT_1_AXI_AW_SEL_TRIG 1 \
  CONFIG.C_SLOT_1_AXI_B_SEL_DATA 1 \
  CONFIG.C_SLOT_1_AXI_B_SEL_TRIG 1 \
  CONFIG.C_SLOT_1_AXI_R_SEL 0 \
  CONFIG.C_SLOT_1_AXI_R_SEL_DATA 0 \
  CONFIG.C_SLOT_1_AXI_R_SEL_TRIG 0 \
  CONFIG.C_SLOT_1_AXI_W_SEL_DATA 1 \
  CONFIG.C_SLOT_1_AXI_W_SEL_TRIG 1 \
  CONFIG.C_SLOT_1_INTF_TYPE xilinx.com:interface:aximm_rtl:1.0 \
  CONFIG.C_SLOT_2_APC_EN 0 \
  CONFIG.C_SLOT_2_AXI_AR_SEL_DATA 1 \
  CONFIG.C_SLOT_2_AXI_AR_SEL_TRIG 1 \
  CONFIG.C_SLOT_2_AXI_AW_SEL_DATA 1 \
  CONFIG.C_SLOT_2_AXI_AW_SEL_TRIG 1 \
  CONFIG.C_SLOT_2_AXI_B_SEL_DATA 1 \
  CONFIG.C_SLOT_2_AXI_B_SEL_TRIG 1 \
  CONFIG.C_SLOT_2_AXI_R_SEL_DATA 1 \
  CONFIG.C_SLOT_2_AXI_R_SEL_TRIG 1 \
  CONFIG.C_SLOT_2_AXI_W_SEL_DATA 1 \
  CONFIG.C_SLOT_2_AXI_W_SEL_TRIG 1 \
  CONFIG.C_SLOT_2_INTF_TYPE xilinx.com:interface:aximm_rtl:1.0 \
  CONFIG.C_SLOT_3_APC_EN 0 \
  CONFIG.C_SLOT_3_AXI_DATA_SEL 1 \
  CONFIG.C_SLOT_3_AXI_TRIG_SEL 1 \
  CONFIG.C_SLOT_3_INTF_TYPE xilinx.com:interface:axis_rtl:1.0 \
  CONFIG.C_SLOT_4_APC_EN 0 \
  CONFIG.C_SLOT_4_AXI_DATA_SEL 1 \
  CONFIG.C_SLOT_4_AXI_TRIG_SEL 1 \
  CONFIG.C_SLOT_4_INTF_TYPE xilinx.com:interface:axis_rtl:1.0 \
  CONFIG.C_SLOT_5_APC_EN 0 \
  CONFIG.C_SLOT_5_AXI_DATA_SEL 1 \
  CONFIG.C_SLOT_5_AXI_TRIG_SEL 1 \
  CONFIG.C_SLOT_5_INTF_TYPE xilinx.com:interface:axis_rtl:1.0 \
  CONFIG.C_SLOT_6_APC_EN 0 \
  CONFIG.C_SLOT_6_AXI_DATA_SEL 1 \
  CONFIG.C_SLOT_6_AXI_TRIG_SEL 1 \
  CONFIG.C_SLOT_6_INTF_TYPE xilinx.com:interface:axis_rtl:1.0 \
  CONFIG.C_SLOT_7_APC_EN 0 \
  CONFIG.C_SLOT_7_AXI_DATA_SEL 1 \
  CONFIG.C_SLOT_7_AXI_TRIG_SEL 1 \
  CONFIG.C_SLOT_7_INTF_TYPE xilinx.com:interface:axis_rtl:1.0 \
  CONFIG.C_SLOT_8_APC_EN 0 \
  CONFIG.C_SLOT_8_AXI_DATA_SEL 1 \
  CONFIG.C_SLOT_8_AXI_TRIG_SEL 1 \
  CONFIG.C_SLOT_8_INTF_TYPE xilinx.com:interface:axis_rtl:1.0 \
  CONFIG.C_SLOT_9_APC_EN 0 \
  CONFIG.C_SLOT_9_AXI_DATA_SEL 1 \
  CONFIG.C_SLOT_9_AXI_TRIG_SEL 1 \
  CONFIG.C_SLOT_9_INTF_TYPE xilinx.com:interface:axis_rtl:1.0 \
] [get_bd_cells system_ila_0]
create_bd_cell -type ip -vlnv xilinx.com:ip:proc_sys_reset:5.0 rst_T510_design_15M
create_bd_cell -type ip -vlnv xilinx.com:ip:xlconcat:2.1 xlconcat_0
create_bd_cell -type ip -vlnv xilinx.com:ip:system_ila:1.1 system_ila_1
set_property -dict [list \
  CONFIG.C_MON_TYPE INTERFACE \
  CONFIG.C_NUM_MONITOR_SLOTS 5 \
  CONFIG.C_SLOT_0_APC_EN 0 \
  CONFIG.C_SLOT_0_AXI_DATA_SEL 1 \
  CONFIG.C_SLOT_0_AXI_TRIG_SEL 1 \
  CONFIG.C_SLOT_0_INTF_TYPE xilinx.com:interface:axis_rtl:1.0 \
  CONFIG.C_SLOT_1_APC_EN 0 \
  CONFIG.C_SLOT_1_AXI_DATA_SEL 1 \
  CONFIG.C_SLOT_1_AXI_TRIG_SEL 1 \
  CONFIG.C_SLOT_1_INTF_TYPE xilinx.com:interface:axis_rtl:1.0 \
  CONFIG.C_SLOT_2_APC_EN 0 \
  CONFIG.C_SLOT_2_AXI_DATA_SEL 1 \
  CONFIG.C_SLOT_2_AXI_TRIG_SEL 1 \
  CONFIG.C_SLOT_2_INTF_TYPE xilinx.com:interface:axis_rtl:1.0 \
  CONFIG.C_SLOT_3_APC_EN 0 \
  CONFIG.C_SLOT_3_AXI_DATA_SEL 1 \
  CONFIG.C_SLOT_3_AXI_TRIG_SEL 1 \
  CONFIG.C_SLOT_3_INTF_TYPE xilinx.com:interface:axis_rtl:1.0 \
  CONFIG.C_SLOT_4_APC_EN 0 \
  CONFIG.C_SLOT_4_AXI_AR_SEL_DATA 1 \
  CONFIG.C_SLOT_4_AXI_AR_SEL_TRIG 1 \
  CONFIG.C_SLOT_4_AXI_AW_SEL_DATA 1 \
  CONFIG.C_SLOT_4_AXI_AW_SEL_TRIG 1 \
  CONFIG.C_SLOT_4_AXI_B_SEL_DATA 1 \
  CONFIG.C_SLOT_4_AXI_B_SEL_TRIG 1 \
  CONFIG.C_SLOT_4_AXI_DATA_SEL 1 \
  CONFIG.C_SLOT_4_AXI_R_SEL_DATA 1 \
  CONFIG.C_SLOT_4_AXI_R_SEL_TRIG 1 \
  CONFIG.C_SLOT_4_AXI_TRIG_SEL 1 \
  CONFIG.C_SLOT_4_AXI_W_SEL_DATA 1 \
  CONFIG.C_SLOT_4_AXI_W_SEL_TRIG 1 \
  CONFIG.C_SLOT_4_INTF_TYPE xilinx.com:interface:aximm_rtl:1.0 \
  CONFIG.C_SLOT_5_APC_EN 0 \
  CONFIG.C_SLOT_5_AXI_DATA_SEL 1 \
  CONFIG.C_SLOT_5_AXI_TRIG_SEL 1 \
  CONFIG.C_SLOT_5_INTF_TYPE xilinx.com:interface:axis_rtl:1.0 \
] [get_bd_cells system_ila_1]
create_bd_cell -type ip -vlnv xilinx.com:ip:system_ila:1.1 system_ila_2
set_property -dict [list \
  CONFIG.C_MON_TYPE INTERFACE \
  CONFIG.C_NUM_MONITOR_SLOTS 2 \
  CONFIG.C_SLOT_0_APC_EN 0 \
  CONFIG.C_SLOT_0_AXI_DATA_SEL 1 \
  CONFIG.C_SLOT_0_AXI_TRIG_SEL 1 \
  CONFIG.C_SLOT_0_INTF_TYPE xilinx.com:interface:axis_rtl:1.0 \
  CONFIG.C_SLOT_1_APC_EN 0 \
  CONFIG.C_SLOT_1_AXI_DATA_SEL 1 \
  CONFIG.C_SLOT_1_AXI_TRIG_SEL 1 \
  CONFIG.C_SLOT_1_INTF_TYPE xilinx.com:interface:axis_rtl:1.0 \
] [get_bd_cells system_ila_2]
create_bd_cell -type ip -vlnv xilinx.com:ip:proc_sys_reset:5.0 rst_T510_design_30M
create_bd_cell -type ip -vlnv xilinx.com:user:tlast_generator:1.0 tlast_generator_0
set_property -dict {CONFIG.BEATS_PER_PERIOD 16384} [get_bd_cells tlast_generator_0]
create_bd_cell -type ip -vlnv xilinx.com:ip:system_ila:1.1 system_ila_3
set_property -dict {CONFIG.C_MON_TYPE NATIVE CONFIG.C_NUM_OF_PROBES 1 CONFIG.C_PROBE0_TYPE 0} [get_bd_cells system_ila_3]
create_bd_cell -type ip -vlnv xilinx.com:ip:system_ila:1.1 system_ila_4
set_property -dict {CONFIG.C_MON_TYPE NATIVE CONFIG.C_NUM_OF_PROBES 1 CONFIG.C_PROBE0_TYPE 0} [get_bd_cells system_ila_4]
create_bd_cell -type ip -vlnv xilinx.com:ip:axi_gpio:2.0 axi_gpio_0
set_property -dict {CONFIG.C_ALL_OUTPUTS 1 CONFIG.C_GPIO_WIDTH 6} [get_bd_cells axi_gpio_0]
create_bd_cell -type ip -vlnv xilinx.com:user:axis_4channel_interfaces:1.0 axis_4channel_interf_0
create_bd_cell -type ip -vlnv xilinx.com:ip:axi_bram_ctrl:4.1 axi_bram_ctrl_0
set_property -dict {CONFIG.SINGLE_PORT_BRAM 1} [get_bd_cells axi_bram_ctrl_0]
create_bd_cell -type ip -vlnv xilinx.com:user:dual_axis_probe_buffer:1.0 dual_axis_probe_buff_0
create_bd_cell -type ip -vlnv xilinx.com:ip:axi_dwidth_converter:2.1 axi_dwidth_converter_0
set_property -dict {CONFIG.MI_DATA_WIDTH 128 CONFIG.SI_DATA_WIDTH 512} [get_bd_cells axi_dwidth_converter_0]
create_bd_cell -type ip -vlnv xilinx.com:ip:axi_interconnect:2.1 axi_interconnect_0
set_property -dict {CONFIG.NUM_MI 1 CONFIG.NUM_SI 3} [get_bd_cells axi_interconnect_0]
create_bd_cell -type ip -vlnv xilinx.com:ip:axi_dwidth_converter:2.1 axi_dwidth_converter_1
set_property -dict {CONFIG.MI_DATA_WIDTH 128 CONFIG.SI_DATA_WIDTH 256} [get_bd_cells axi_dwidth_converter_1]
create_bd_cell -type ip -vlnv xilinx.com:ip:axis_combiner:1.1 axis_combiner_1
set_property -dict {CONFIG.NUM_SI 4 CONFIG.TDATA_NUM_BYTES 16} [get_bd_cells axis_combiner_1]
create_bd_cell -type ip -vlnv xilinx.com:user:chanmajor_to_timemajor:1.0 chanmajor_to_timemaj_0
create_bd_cell -type ip -vlnv xilinx.com:user:axis_fir_bypass_mux:1.0 axis_fir_bypass_mux_0
create_bd_cell -type ip -vlnv xilinx.com:ip:xlslice:1.0 xlslice_0
set_property -dict {CONFIG.DIN_FROM 4 CONFIG.DIN_TO 4 CONFIG.DIN_WIDTH 6} [get_bd_cells xlslice_0]
create_bd_cell -type ip -vlnv xilinx.com:ip:xlslice:1.0 xlslice_1
set_property -dict {CONFIG.DIN_FROM 3 CONFIG.DIN_TO 0 CONFIG.DIN_WIDTH 6} [get_bd_cells xlslice_1]
create_bd_cell -type ip -vlnv xilinx.com:ip:fir_compiler:7.2 fir_compiler_rx
set_property -dict [list \
  CONFIG.Clock_Frequency 15.36 \
  CONFIG.CoefficientSource Vector \
  CONFIG.CoefficientVector 0,0,0,0,0,0,0,0,0,0,0,0,0,0,0,1,0,0,0,0,0,0,0,0,0,0,0,0,0,0,0 \
  CONFIG.Coefficient_Fractional_Bits 0 \
  CONFIG.Coefficient_Reload true \
  CONFIG.Coefficient_Sets 1 \
  CONFIG.Coefficient_Sign Signed \
  CONFIG.Coefficient_Structure Non_Symmetric \
  CONFIG.Coefficient_Width 20 \
  CONFIG.DATA_Has_TLAST Not_Required \
  CONFIG.Decimation_Rate 1 \
  CONFIG.Filter_Architecture Systolic_Multiply_Accumulate \
  CONFIG.Filter_Type Single_Rate \
  CONFIG.Has_ARESETn true \
  CONFIG.Interpolation_Rate 1 \
  CONFIG.M_DATA_Has_TREADY true \
  CONFIG.M_DATA_Has_TUSER Not_Required \
  CONFIG.Number_Paths 4 \
  CONFIG.Optimization_Goal Speed \
  CONFIG.Output_Rounding_Mode Convergent_Rounding_to_Even \
  CONFIG.Output_Width 16 \
  CONFIG.Quantization Integer_Coefficients \
  CONFIG.RateSpecification Frequency_Specification \
  CONFIG.S_DATA_Has_TUSER Not_Required \
  CONFIG.Sample_Frequency 122.88 \
  CONFIG.Zero_Pack_Factor 1 \
] [get_bd_cells fir_compiler_rx]
create_bd_cell -type module -reference programmable_decim programmable_decim_0
create_bd_cell -type module -reference iq_quantizer_vec iq_quantizer_vec_0
create_bd_cell -type module -reference iq_bit_packer iq_bit_packer_0
create_bd_cell -type module -reference record_replay_ctrl_rx record_replay_ctrl_rx_0
create_bd_cell -type ip -vlnv xilinx.com:ip:axis_data_fifo:2.0 axis_data_fifo_tx_cdc
set_property -dict {CONFIG.FIFO_DEPTH 4096 CONFIG.IS_ACLK_ASYNC 1 CONFIG.TDATA_NUM_BYTES 32} [get_bd_cells axis_data_fifo_tx_cdc]
create_bd_cell -type module -reference iq_bit_unpacker_tx iq_bit_unpacker_tx_0
create_bd_cell -type module -reference programmable_interp_tx programmable_interp_tx_0
create_bd_cell -type module -reference iq_requant_tx iq_requant_tx_0
create_bd_cell -type module -reference iq_tx_formatter iq_tx_formatter_0
create_bd_cell -type module -reference record_replay_ctrl_tx record_replay_ctrl_tx_0
create_bd_cell -type ip -vlnv xilinx.com:ip:fir_compiler:7.2 fir_compiler_tx
set_property -dict [list \
  CONFIG.Clock_Frequency 30.72 \
  CONFIG.CoefficientSource Vector \
  CONFIG.CoefficientVector 0,0,0,0,0,0,0,0,0,0,0,0,0,0,0,1,0,0,0,0,0,0,0,0,0,0,0,0,0,0,0 \
  CONFIG.Coefficient_Fractional_Bits 0 \
  CONFIG.Coefficient_Reload true \
  CONFIG.Coefficient_Sets 1 \
  CONFIG.Coefficient_Sign Signed \
  CONFIG.Coefficient_Structure Non_Symmetric \
  CONFIG.Coefficient_Width 20 \
  CONFIG.DATA_Has_TLAST Not_Required \
  CONFIG.Decimation_Rate 1 \
  CONFIG.Filter_Architecture Systolic_Multiply_Accumulate \
  CONFIG.Filter_Type Single_Rate \
  CONFIG.Has_ARESETn true \
  CONFIG.Interpolation_Rate 1 \
  CONFIG.M_DATA_Has_TREADY true \
  CONFIG.M_DATA_Has_TUSER Not_Required \
  CONFIG.Number_Paths 4 \
  CONFIG.Optimization_Goal Speed \
  CONFIG.Output_Rounding_Mode Convergent_Rounding_to_Even \
  CONFIG.Output_Width 16 \
  CONFIG.Quantization Integer_Coefficients \
  CONFIG.RateSpecification Frequency_Specification \
  CONFIG.S_DATA_Has_TUSER Not_Required \
  CONFIG.Sample_Frequency 122.88 \
  CONFIG.Zero_Pack_Factor 1 \
] [get_bd_cells fir_compiler_tx]
create_bd_cell -type ip -vlnv xilinx.com:ip:xlslice:1.0 xlslice_2
set_property -dict {CONFIG.DIN_FROM 5 CONFIG.DIN_TO 5 CONFIG.DIN_WIDTH 6} [get_bd_cells xlslice_2]
create_bd_cell -type ip -vlnv xilinx.com:user:axis_fir_bypass_mux:1.0 axis_fir_bypass_mux_tx_0

# ---- connections ----

connect_bd_intf_net [get_bd_intf_ports adc0_clk] [get_bd_intf_pins usp_rf_data_converter_0/adc0_clk]
connect_bd_intf_net [get_bd_intf_pins axi_dma_0/M_AXIS_MM2S] [get_bd_intf_pins axis_data_fifo_tx_cdc/S_AXIS]
connect_bd_intf_net [get_bd_intf_pins axi_dwidth_converter_1/S_AXI] [get_bd_intf_pins axi_dma_0/M_AXI_MM2S]
connect_bd_intf_net [get_bd_intf_pins axi_dma_0/M_AXI_S2MM] [get_bd_intf_pins axi_dwidth_converter_0/S_AXI]
connect_bd_intf_net [get_bd_intf_pins axi_dma_0/M_AXI_SG] [get_bd_intf_pins axi_interconnect_0/S01_AXI]
connect_bd_intf_net [get_bd_intf_pins axi_dma_0/M_AXI_SG] [get_bd_intf_pins system_ila_0/SLOT_1_AXI]
connect_bd_intf_net [get_bd_intf_pins axi_dwidth_converter_0/M_AXI] [get_bd_intf_pins axi_interconnect_0/S00_AXI]
connect_bd_intf_net [get_bd_intf_pins axi_dwidth_converter_0/M_AXI] [get_bd_intf_pins system_ila_0/SLOT_0_AXI]
connect_bd_intf_net [get_bd_intf_pins axi_dwidth_converter_1/M_AXI] [get_bd_intf_pins axi_interconnect_0/S02_AXI]
connect_bd_intf_net [get_bd_intf_pins axi_dwidth_converter_1/M_AXI] [get_bd_intf_pins system_ila_0/SLOT_2_AXI]
connect_bd_intf_net [get_bd_intf_pins zynq_ultra_ps_e_0/S_AXI_HPC0_FPD] [get_bd_intf_pins axi_interconnect_0/M00_AXI]
connect_bd_intf_net [get_bd_intf_pins axis_combiner_1/S00_AXIS] [get_bd_intf_pins axis_4channel_interf_0/m00_axis]
connect_bd_intf_net [get_bd_intf_pins axis_4channel_interf_0/m01_axis] [get_bd_intf_pins axis_combiner_1/S01_AXIS]
connect_bd_intf_net [get_bd_intf_pins axis_4channel_interf_0/m02_axis] [get_bd_intf_pins axis_combiner_1/S02_AXIS]
connect_bd_intf_net [get_bd_intf_pins axis_4channel_interf_0/m03_axis] [get_bd_intf_pins axis_combiner_1/S03_AXIS]
connect_bd_intf_net [get_bd_intf_pins axis_broadcaster_0/M00_AXIS] [get_bd_intf_pins axis_subset_converter_0/S_AXIS]
connect_bd_intf_net [get_bd_intf_pins axis_broadcaster_0/M00_AXIS] [get_bd_intf_pins system_ila_0/SLOT_4_AXIS]
connect_bd_intf_net [get_bd_intf_pins axis_broadcaster_0/M01_AXIS] [get_bd_intf_pins axis_subset_converter_1/S_AXIS]
connect_bd_intf_net [get_bd_intf_pins axis_broadcaster_0/M01_AXIS] [get_bd_intf_pins system_ila_0/SLOT_5_AXIS]
connect_bd_intf_net [get_bd_intf_pins axi_dma_0/S_AXIS_S2MM] [get_bd_intf_pins tlast_generator_0/m_axis]
connect_bd_intf_net [get_bd_intf_pins axi_dma_0/S_AXIS_S2MM] [get_bd_intf_pins system_ila_0/SLOT_6_AXIS]
connect_bd_intf_net [get_bd_intf_pins axis_data_fifo_2/M_AXIS] [get_bd_intf_pins tlast_generator_0/s_axis]
connect_bd_intf_net [get_bd_intf_pins axis_data_fifo_2/M_AXIS] [get_bd_intf_pins system_ila_0/SLOT_7_AXIS]
connect_bd_intf_net [get_bd_intf_pins axis_data_fifo_tx_cdc/M_AXIS] [get_bd_intf_pins iq_bit_unpacker_tx_0/S_AXIS]
connect_bd_intf_net [get_bd_intf_pins axis_fir_bypass_mux_0/m_axis] [get_bd_intf_pins programmable_decim_0/S_AXIS]
connect_bd_intf_net [get_bd_intf_pins axis_fir_bypass_mux_0/m_axis_fir] [get_bd_intf_pins fir_compiler_rx/S_AXIS_DATA]
connect_bd_intf_net [get_bd_intf_pins axis_fir_bypass_mux_tx_0/m_axis] [get_bd_intf_pins iq_requant_tx_0/S_AXIS]
connect_bd_intf_net [get_bd_intf_pins axis_fir_bypass_mux_tx_0/m_axis_fir] [get_bd_intf_pins fir_compiler_tx/S_AXIS_DATA]
connect_bd_intf_net [get_bd_intf_pins axis_subset_converter_0/M_AXIS] [get_bd_intf_pins axis_data_fifo_0/S_AXIS]
connect_bd_intf_net [get_bd_intf_pins axis_subset_converter_0/M_AXIS] [get_bd_intf_pins system_ila_0/SLOT_8_AXIS]
connect_bd_intf_net [get_bd_intf_pins axis_subset_converter_1/M_AXIS] [get_bd_intf_pins axis_data_fifo_1/S_AXIS]
connect_bd_intf_net [get_bd_intf_pins axis_subset_converter_1/M_AXIS] [get_bd_intf_pins system_ila_0/SLOT_9_AXIS]
connect_bd_intf_net [get_bd_intf_pins axis_fir_bypass_mux_0/s_axis] [get_bd_intf_pins chanmajor_to_timemaj_0/m_axis]
connect_bd_intf_net [get_bd_intf_ports dac0_clk] [get_bd_intf_pins usp_rf_data_converter_0/dac0_clk]
connect_bd_intf_net [get_bd_intf_pins dual_axis_probe_buff_0/m00_axis] [get_bd_intf_pins usp_rf_data_converter_0/s00_axis]
connect_bd_intf_net [get_bd_intf_pins usp_rf_data_converter_0/s02_axis] [get_bd_intf_pins dual_axis_probe_buff_0/m01_axis]
connect_bd_intf_net [get_bd_intf_pins fir_compiler_rx/M_AXIS_DATA] [get_bd_intf_pins axis_fir_bypass_mux_0/s_axis_fir]
connect_bd_intf_net [get_bd_intf_pins fir_compiler_tx/M_AXIS_DATA] [get_bd_intf_pins axis_fir_bypass_mux_tx_0/s_axis_fir]
connect_bd_intf_net [get_bd_intf_pins iq_bit_packer_0/M_AXIS] [get_bd_intf_pins axis_data_fifo_2/S_AXIS]
connect_bd_intf_net [get_bd_intf_pins iq_bit_unpacker_tx_0/M_AXIS] [get_bd_intf_pins programmable_interp_tx_0/S_AXIS]
connect_bd_intf_net [get_bd_intf_pins iq_quantizer_vec_0/M_AXIS] [get_bd_intf_pins iq_bit_packer_0/S_AXIS]
connect_bd_intf_net [get_bd_intf_pins iq_requant_tx_0/M_AXIS] [get_bd_intf_pins iq_tx_formatter_0/S_AXIS]
connect_bd_intf_net [get_bd_intf_pins iq_tx_formatter_0/M_BAND0] [get_bd_intf_pins dual_axis_probe_buff_0/s00_axis]
connect_bd_intf_net [get_bd_intf_pins iq_tx_formatter_0/M_BAND1] [get_bd_intf_pins dual_axis_probe_buff_0/s01_axis]
connect_bd_intf_net [get_bd_intf_pins programmable_decim_0/M_AXIS] [get_bd_intf_pins iq_quantizer_vec_0/S_AXIS]
connect_bd_intf_net [get_bd_intf_pins programmable_interp_tx_0/M_AXIS] [get_bd_intf_pins axis_fir_bypass_mux_tx_0/s_axis]
connect_bd_intf_net [get_bd_intf_pins ps8_0_axi_periph/M00_AXI] [get_bd_intf_pins usp_rf_data_converter_0/s_axi]
connect_bd_intf_net [get_bd_intf_pins ps8_0_axi_periph/M00_AXI] [get_bd_intf_pins system_ila_1/SLOT_4_AXI]
connect_bd_intf_net [get_bd_intf_pins ps8_0_axi_periph/M01_AXI] [get_bd_intf_pins axi_dma_0/S_AXI_LITE]
connect_bd_intf_net [get_bd_intf_pins ps8_0_axi_periph/M02_AXI] [get_bd_intf_pins axi_gpio_0/S_AXI]
connect_bd_intf_net [get_bd_intf_pins ps8_0_axi_periph/M03_AXI] [get_bd_intf_pins axi_bram_ctrl_0/S_AXI]
connect_bd_intf_net [get_bd_intf_pins ps8_0_axi_periph/M04_AXI] [get_bd_intf_pins record_replay_ctrl_rx_0/S_AXI]
connect_bd_intf_net [get_bd_intf_pins ps8_0_axi_periph/M05_AXI] [get_bd_intf_pins record_replay_ctrl_tx_0/S_AXI]
connect_bd_intf_net [get_bd_intf_pins record_replay_ctrl_rx_0/M_AXIS_CONFIG] [get_bd_intf_pins fir_compiler_rx/S_AXIS_CONFIG]
connect_bd_intf_net [get_bd_intf_pins record_replay_ctrl_rx_0/M_AXIS_RELOAD] [get_bd_intf_pins fir_compiler_rx/S_AXIS_RELOAD]
connect_bd_intf_net [get_bd_intf_pins record_replay_ctrl_tx_0/M_AXIS_CONFIG] [get_bd_intf_pins fir_compiler_tx/S_AXIS_CONFIG]
connect_bd_intf_net [get_bd_intf_pins record_replay_ctrl_tx_0/M_AXIS_RELOAD] [get_bd_intf_pins fir_compiler_tx/S_AXIS_RELOAD]
connect_bd_intf_net [get_bd_intf_ports sysref_in] [get_bd_intf_pins usp_rf_data_converter_0/sysref_in]
connect_bd_intf_net [get_bd_intf_pins axis_combiner_1/M_AXIS] [get_bd_intf_pins chanmajor_to_timemaj_0/s_axis]
connect_bd_intf_net [get_bd_intf_pins axis_combiner_1/M_AXIS] [get_bd_intf_pins system_ila_1/SLOT_2_AXIS]
connect_bd_intf_net [get_bd_intf_pins usp_rf_data_converter_0/m00_axis] [get_bd_intf_pins axis_4channel_interf_0/s00_axis]
connect_bd_intf_net [get_bd_intf_pins usp_rf_data_converter_0/m01_axis] [get_bd_intf_pins axis_4channel_interf_0/s01_axis]
connect_bd_intf_net [get_bd_intf_pins axis_4channel_interf_0/s02_axis] [get_bd_intf_pins usp_rf_data_converter_0/m02_axis]
connect_bd_intf_net [get_bd_intf_pins usp_rf_data_converter_0/m03_axis] [get_bd_intf_pins axis_4channel_interf_0/s03_axis]
connect_bd_intf_net [get_bd_intf_ports vout00] [get_bd_intf_pins usp_rf_data_converter_0/vout00]
connect_bd_intf_net [get_bd_intf_ports vout02] [get_bd_intf_pins usp_rf_data_converter_0/vout02]
connect_bd_intf_net [get_bd_intf_ports vin0_01] [get_bd_intf_pins usp_rf_data_converter_0/vin0_01]
connect_bd_intf_net [get_bd_intf_ports vin0_23] [get_bd_intf_pins usp_rf_data_converter_0/vin0_23]
connect_bd_intf_net [get_bd_intf_ports emio_tri_io] [get_bd_intf_pins zynq_ultra_ps_e_0/GPIO_0]
connect_bd_intf_net [get_bd_intf_ports iic] [get_bd_intf_pins zynq_ultra_ps_e_0/IIC_1]
connect_bd_intf_net [get_bd_intf_pins zynq_ultra_ps_e_0/M_AXI_HPM0_LPD] [get_bd_intf_pins ps8_0_axi_periph/S00_AXI]
connect_bd_net [get_bd_pins axi_bram_ctrl_0/bram_addr_a] [get_bd_pins dual_axis_probe_buff_0/bram_addr]
connect_bd_net [get_bd_pins axi_bram_ctrl_0/bram_clk_a] [get_bd_pins dual_axis_probe_buff_0/pclk]
connect_bd_net [get_bd_pins axi_bram_ctrl_0/bram_en_a] [get_bd_pins dual_axis_probe_buff_0/bram_en]
connect_bd_net [get_bd_pins axi_bram_ctrl_0/bram_we_a] [get_bd_pins dual_axis_probe_buff_0/bram_we]
connect_bd_net -net axi_dma_0_mm2s_introut [get_bd_pins axi_dma_0/mm2s_introut] [get_bd_pins xlconcat_0/In0] [get_bd_pins system_ila_3/probe0]
connect_bd_net -net axi_dma_0_s2mm_introut [get_bd_pins axi_dma_0/s2mm_introut] [get_bd_pins xlconcat_0/In1] [get_bd_pins system_ila_4/probe0]
connect_bd_net [get_bd_pins axi_gpio_0/gpio_io_o] [get_bd_pins xlslice_0/Din] [get_bd_pins xlslice_1/Din] [get_bd_pins xlslice_2/Din]
connect_bd_net [get_bd_pins clk_wiz_0/clk_out1] \
  [get_bd_ports adc_m_axis_clk] [get_bd_pins axis_data_fifo_2/s_axis_aclk] [get_bd_pins ps8_0_axi_periph/M00_ACLK] \
  [get_bd_pins rst_T510_design_15M/slowest_sync_clk] [get_bd_pins system_ila_1/clk] \
  [get_bd_pins usp_rf_data_converter_0/s_axi_aclk] [get_bd_pins usp_rf_data_converter_0/m0_axis_aclk] \
  [get_bd_pins axis_combiner_1/aclk] [get_bd_pins chanmajor_to_timemaj_0/aclk] [get_bd_pins axis_fir_bypass_mux_0/aclk] \
  [get_bd_pins axis_4channel_interf_0/clk] [get_bd_pins fir_compiler_rx/aclk] [get_bd_pins programmable_decim_0/aclk] \
  [get_bd_pins iq_quantizer_vec_0/aclk] [get_bd_pins iq_bit_packer_0/aclk] [get_bd_pins ps8_0_axi_periph/M04_ACLK] \
  [get_bd_pins record_replay_ctrl_rx_0/aclk]
connect_bd_net [get_bd_pins clk_wiz_0/clk_out2] \
  [get_bd_pins axis_data_fifo_0/m_axis_aclk] [get_bd_pins axis_data_fifo_1/m_axis_aclk] \
  [get_bd_pins rst_T510_design_30M/slowest_sync_clk] [get_bd_pins system_ila_2/clk] \
  [get_bd_pins usp_rf_data_converter_0/s0_axis_aclk] [get_bd_pins dual_axis_probe_buff_0/axis_aclk] \
  [get_bd_pins axis_data_fifo_tx_cdc/m_axis_aclk] [get_bd_pins fir_compiler_tx/aclk] [get_bd_pins ps8_0_axi_periph/M05_ACLK] \
  [get_bd_pins axis_fir_bypass_mux_tx_0/aclk] [get_bd_pins iq_tx_formatter_0/aclk] [get_bd_pins iq_requant_tx_0/aclk] \
  [get_bd_pins programmable_interp_tx_0/aclk] [get_bd_pins iq_bit_unpacker_tx_0/aclk] \
  [get_bd_pins record_replay_ctrl_tx_0/aclk]
connect_bd_net [get_bd_pins clk_wiz_0/locked] \
  [get_bd_ports data_rst_n] [get_bd_pins rst_clk_wiz_0_61M/dcm_locked] [get_bd_pins usp_rf_data_converter_0/s_axi_aresetn] \
  [get_bd_pins usp_rf_data_converter_0/m0_axis_aresetn]
connect_bd_net [get_bd_pins dual_axis_probe_buff_0/bram_rddata] [get_bd_pins axi_bram_ctrl_0/bram_rddata_a]
connect_bd_net [get_bd_pins iq_bit_packer_0/overflow_cnt] [get_bd_pins record_replay_ctrl_rx_0/overflow_cnt]
connect_bd_net [get_bd_pins iq_bit_packer_0/pack_fill] [get_bd_pins record_replay_ctrl_rx_0/pack_fill]
connect_bd_net [get_bd_pins iq_quantizer_vec_0/sat_count] [get_bd_pins record_replay_ctrl_rx_0/sat_count]
connect_bd_net [get_bd_pins iq_requant_tx_0/clip_count] [get_bd_pins record_replay_ctrl_tx_0/clip_count]
connect_bd_net -net pl_clk_n_0_1 [get_bd_ports pl_clk_n] [get_bd_pins pl_mts_sync_clk_0/pl_clk_n]
connect_bd_net -net pl_clk_p_0_1 [get_bd_ports pl_clk_p] [get_bd_pins pl_mts_sync_clk_0/pl_clk_p]
connect_bd_net [get_bd_pins pl_mts_sync_clk_0/pl_clk] [get_bd_pins clk_wiz_0/clk_in1]
connect_bd_net -net pl_sys_ref_n_0_1 [get_bd_ports pl_sys_ref_n] [get_bd_pins pl_mts_sync_clk_0/pl_sys_ref_n]
connect_bd_net -net pl_sys_ref_p_0_1 [get_bd_ports pl_sys_ref_p] [get_bd_pins pl_mts_sync_clk_0/pl_sys_ref_p]
connect_bd_net [get_bd_pins programmable_decim_0/drop_count] [get_bd_pins record_replay_ctrl_rx_0/drop_count]
connect_bd_net [get_bd_pins programmable_decim_0/in_beat_count] [get_bd_pins record_replay_ctrl_rx_0/in_beat_count]
connect_bd_net [get_bd_pins programmable_decim_0/out_beat_count] [get_bd_pins record_replay_ctrl_rx_0/out_beat_count]
connect_bd_net [get_bd_pins programmable_decim_0/sample_count] [get_bd_pins record_replay_ctrl_rx_0/sample_count]
connect_bd_net [get_bd_pins programmable_interp_tx_0/in_beat_count] [get_bd_pins record_replay_ctrl_tx_0/in_beat_count]
connect_bd_net [get_bd_pins programmable_interp_tx_0/out_beat_count] [get_bd_pins record_replay_ctrl_tx_0/out_beat_count]
connect_bd_net [get_bd_pins record_replay_ctrl_rx_0/BAND_DUAL] [get_bd_pins iq_bit_packer_0/BAND_DUAL]
connect_bd_net [get_bd_pins record_replay_ctrl_rx_0/BIT_MODE] [get_bd_pins iq_quantizer_vec_0/BIT_MODE] [get_bd_pins iq_bit_packer_0/BIT_MODE]
connect_bd_net [get_bd_pins record_replay_ctrl_rx_0/DECIM_M] [get_bd_pins programmable_decim_0/DECIM_M]
connect_bd_net [get_bd_pins record_replay_ctrl_rx_0/DECIM_PHASE] [get_bd_pins programmable_decim_0/DECIM_PHASE]
connect_bd_net [get_bd_pins record_replay_ctrl_rx_0/QUANT_2BIT_THR] [get_bd_pins iq_quantizer_vec_0/QUANT_2BIT_THR]
connect_bd_net [get_bd_pins record_replay_ctrl_rx_0/QUANT_SHIFT] [get_bd_pins iq_quantizer_vec_0/QUANT_SHIFT]
connect_bd_net [get_bd_pins record_replay_ctrl_rx_0/cnt_clr] \
  [get_bd_pins programmable_decim_0/cnt_clr] [get_bd_pins iq_quantizer_vec_0/cnt_clr] [get_bd_pins iq_bit_packer_0/cnt_clr]
connect_bd_net [get_bd_pins record_replay_ctrl_tx_0/BAND_DUAL] \
  [get_bd_pins iq_tx_formatter_0/BAND_DUAL] [get_bd_pins iq_requant_tx_0/BAND_DUAL] \
  [get_bd_pins iq_bit_unpacker_tx_0/BAND_DUAL]
connect_bd_net [get_bd_pins record_replay_ctrl_tx_0/BIT_MODE] [get_bd_pins iq_bit_unpacker_tx_0/BIT_MODE]
connect_bd_net [get_bd_pins record_replay_ctrl_tx_0/INTERP_M] [get_bd_pins programmable_interp_tx_0/INTERP_M]
connect_bd_net [get_bd_pins record_replay_ctrl_tx_0/INTERP_PHASE] [get_bd_pins programmable_interp_tx_0/INTERP_PHASE]
connect_bd_net [get_bd_pins record_replay_ctrl_tx_0/LIMIT] [get_bd_pins iq_requant_tx_0/LIMIT]
connect_bd_net [get_bd_pins record_replay_ctrl_tx_0/SCALE_SHIFT] [get_bd_pins iq_requant_tx_0/SCALE_SHIFT]
connect_bd_net [get_bd_pins record_replay_ctrl_tx_0/cnt_clr] \
  [get_bd_pins iq_tx_formatter_0/cnt_clr] [get_bd_pins iq_requant_tx_0/cnt_clr] \
  [get_bd_pins programmable_interp_tx_0/cnt_clr] [get_bd_pins iq_bit_unpacker_tx_0/cnt_clr]
connect_bd_net [get_bd_pins rst_T510_design_15M/interconnect_aresetn] \
  [get_bd_pins axis_data_fifo_2/s_axis_aresetn] [get_bd_pins chanmajor_to_timemaj_0/aresetn] \
  [get_bd_pins axis_fir_bypass_mux_0/aresetn] [get_bd_pins axis_4channel_interf_0/resetn] \
  [get_bd_pins fir_compiler_rx/aresetn] [get_bd_pins programmable_decim_0/aresetn] [get_bd_pins iq_quantizer_vec_0/aresetn] \
  [get_bd_pins iq_bit_packer_0/aresetn]
connect_bd_net [get_bd_pins rst_T510_design_15M/peripheral_aresetn] \
  [get_bd_pins ps8_0_axi_periph/M00_ARESETN] [get_bd_pins system_ila_1/resetn] [get_bd_pins axis_combiner_1/aresetn] \
  [get_bd_pins ps8_0_axi_periph/M04_ARESETN] [get_bd_pins record_replay_ctrl_rx_0/aresetn]
connect_bd_net [get_bd_pins rst_T510_design_30M/interconnect_aresetn] \
  [get_bd_pins usp_rf_data_converter_0/s0_axis_aresetn] [get_bd_pins fir_compiler_tx/aresetn] \
  [get_bd_pins axis_fir_bypass_mux_tx_0/aresetn] [get_bd_pins iq_requant_tx_0/aresetn] \
  [get_bd_pins programmable_interp_tx_0/aresetn] [get_bd_pins iq_bit_unpacker_tx_0/aresetn]
connect_bd_net [get_bd_pins rst_T510_design_30M/peripheral_aresetn] \
  [get_bd_pins system_ila_2/resetn] [get_bd_pins dual_axis_probe_buff_0/axis_aresetn] \
  [get_bd_pins ps8_0_axi_periph/M05_ARESETN] [get_bd_pins record_replay_ctrl_tx_0/aresetn]
connect_bd_net [get_bd_pins rst_clk_wiz_0_61M/peripheral_aresetn] \
  [get_bd_pins axis_data_fifo_1/s_axis_aresetn] [get_bd_pins system_ila_0/resetn] [get_bd_pins ps8_0_axi_periph/S01_ARESETN]
connect_bd_net [get_bd_pins rst_ps8_0_99M/peripheral_aresetn] \
  [get_bd_pins axi_dma_0/axi_resetn] [get_bd_pins axis_broadcaster_0/aresetn] [get_bd_pins axis_data_fifo_0/s_axis_aresetn] \
  [get_bd_pins axis_subset_converter_0/aresetn] [get_bd_pins axis_subset_converter_1/aresetn] \
  [get_bd_pins ps8_0_axi_periph/ARESETN] [get_bd_pins ps8_0_axi_periph/S00_ARESETN] \
  [get_bd_pins ps8_0_axi_periph/M01_ARESETN] [get_bd_pins axi_gpio_0/s_axi_aresetn] \
  [get_bd_pins ps8_0_axi_periph/M02_ARESETN] [get_bd_pins ps8_0_axi_periph/M03_ARESETN] \
  [get_bd_pins axi_bram_ctrl_0/s_axi_aresetn] [get_bd_pins axi_dwidth_converter_0/s_axi_aresetn] \
  [get_bd_pins axi_dwidth_converter_1/s_axi_aresetn] [get_bd_pins axi_interconnect_0/ARESETN] \
  [get_bd_pins axi_interconnect_0/S00_ARESETN] [get_bd_pins axi_interconnect_0/M00_ARESETN] \
  [get_bd_pins axi_interconnect_0/S01_ARESETN] [get_bd_pins axi_interconnect_0/S02_ARESETN] \
  [get_bd_pins dual_axis_probe_buff_0/presetn] [get_bd_pins tlast_generator_0/aresetn] \
  [get_bd_pins axis_data_fifo_tx_cdc/s_axis_aresetn]
connect_bd_net [get_bd_pins usp_rf_data_converter_0/clk_adc0] [get_bd_ports clk_adc0_0]
connect_bd_net [get_bd_pins usp_rf_data_converter_0/clk_dac0] [get_bd_ports clk_dac0_0]
connect_bd_net [get_bd_pins xlconcat_0/dout] [get_bd_pins zynq_ultra_ps_e_0/pl_ps_irq0]
connect_bd_net [get_bd_pins xlslice_0/Dout] [get_bd_pins axis_fir_bypass_mux_0/sel]
connect_bd_net [get_bd_pins xlslice_1/Dout] [get_bd_pins axis_4channel_interf_0/sel]
connect_bd_net [get_bd_pins xlslice_2/Dout] [get_bd_pins axis_fir_bypass_mux_tx_0/sel]
